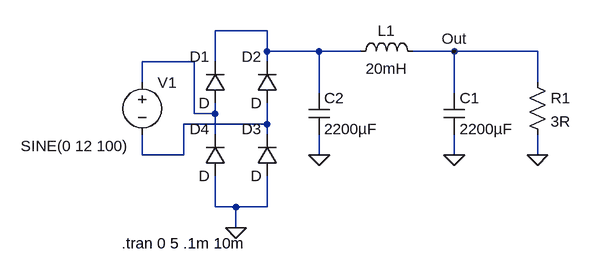
[diagram p0: schematic Filtr_LC_Supply.asc]
Filtr_LC_Supply.asc, the LTspice schematic file:
Version 4
SHEET 1 880 680
WIRE -64 112 -144 112
WIRE -64 144 -64 112
WIRE 16 144 -64 144
WIRE 80 144 16 144
WIRE 224 144 160 144
WIRE 352 144 224 144
WIRE -176 160 -256 160
WIRE -144 160 -144 112
WIRE -64 160 -64 144
WIRE -256 192 -256 160
WIRE 352 192 352 144
WIRE 16 208 16 144
WIRE 224 208 224 144
WIRE -176 240 -176 160
WIRE -144 240 -144 224
WIRE -144 240 -176 240
WIRE -64 256 -64 224
WIRE -64 256 -192 256
WIRE -144 272 -144 240
WIRE -64 272 -64 256
WIRE -256 304 -256 272
WIRE -192 304 -192 256
WIRE -192 304 -256 304
WIRE 16 304 16 272
WIRE 224 304 224 272
WIRE 352 304 352 272
WIRE -144 384 -144 336
WIRE -112 384 -144 384
WIRE -64 384 -64 336
WIRE -64 384 -112 384
WIRE -112 416 -112 384
FLAG 224 304 0
FLAG -112 416 0
FLAG 224 144 Out
FLAG 352 304 0
FLAG 16 304 0
SYMBOL ind 64 160 R270
WINDOW 0 32 56 VTop 0
WINDOW 3 5 56 VBottom 0
SYMATTR InstName L1
SYMATTR Value 20mH
SYMBOL cap 208 208 R0
SYMATTR InstName C1
SYMATTR Value 2200µF
SYMBOL voltage -256 176 R0
WINDOW 123 0 0 Left 0
WINDOW 39 0 0 Left 0
WINDOW 3 -187 114 Left 0
SYMATTR Value SINE(0 12 100)
SYMATTR InstName V1
SYMBOL diode -128 224 R180
WINDOW 0 24 72 Left 0
WINDOW 3 24 0 Left 0
SYMATTR InstName D1
SYMBOL diode -48 224 R180
WINDOW 0 24 72 Left 0
WINDOW 3 24 0 Left 0
SYMATTR InstName D2
SYMBOL diode -48 336 R180
WINDOW 0 24 72 Left 0
WINDOW 3 24 0 Left 0
SYMATTR InstName D3
SYMBOL diode -128 336 R180
WINDOW 0 24 72 Left 0
WINDOW 3 24 0 Left 0
SYMATTR InstName D4
SYMBOL res 336 176 R0
SYMATTR InstName R1
SYMATTR Value 3R
SYMBOL cap 0 208 R0
SYMATTR InstName C2
SYMATTR Value 2200µF
TEXT -288 440 Left 0 !.tran 0 5 .1m 10m

The netlist it stands for:
* Filtr_LC_Supply.asc
L1 N001 Out 20mH
C1 Out 0 2200µF
V1 N002 N003 SINE(0 12 100)
D1 N002 N001 D
D2 N003 N001 D
D3 0 N003 D
D4 0 N002 D
R1 Out 0 3R
C2 N001 0 2200µF
.model D D
.lib standard.dio
.tran 0 5 .1m 10m
.backanno
.end